# Altium schematic sheet Encoder.SchDoc: Mini Editor Keyboard
size A3; DrawnBy: Roman Sklyar; Organization: S-LAB; Address1: Russian Federation; Address2: Sergiev Posad; DocumentNumber: 5; Revision: v1.0; SheetNumber: 5; SheetTotal: 6
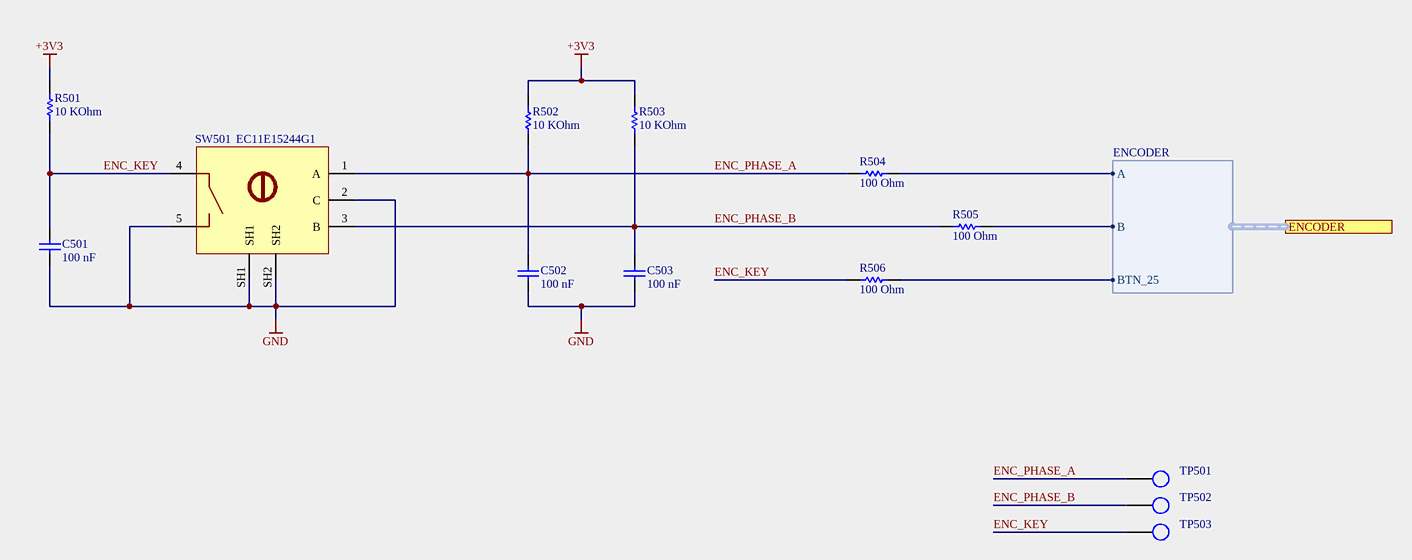
[diagram p0: Encoder.SchDoc]

## Parts
C501  Capacitance: 100 nF  [CAPC0603]  (hidden comment: CAP-100N)
C502  Capacitance: 100 nF  [CAPC0603]  (hidden comment: CAP-100N)
C503  Capacitance: 100 nF  [CAPC0603]  (hidden comment: CAP-100N)
R501  Resistance: 10 KOhm  [RES0603]  (hidden comment: RES-10K)
R502  Resistance: 10 KOhm  [RES0603]  (hidden comment: RES-10K)
R503  Resistance: 10 KOhm  [RES0603]  (hidden comment: RES-10K)
R504  Resistance: 100 Ohm  [RES0603]  (hidden comment: RES-100)
R505  Resistance: 100 Ohm  [RES0603]  (hidden comment: RES-100)
R506  Resistance: 100 Ohm  [RES0603]  (hidden comment: RES-100)
SW501  EC11E15244G1  [EC11E15244G1]
TP501  (no value)  [TP_C-0.5mm]  (no BOM)
TP502  (no value)  [TP_C-0.5mm]  (no BOM)
TP503  (no value)  [TP_C-0.5mm]  (no BOM)

## Ports
ENCODER (harness ENCODER)

## Harnesses
ENCODER: A, B, BTN_25

## Nets
+3V3: R501.2 R502.2 R503.2
GND: C501.1 C502.1 C503.1 SW501.2(C) SW501.5 SW501.SH1 SW501.SH2
ENC_KEY: C501.2 R501.1 R506.1 SW501.4 TP503.1
ENC_PHASE_A: C502.2 R502.1 R504.1 SW501.1(A) TP501.1
ENC_PHASE_B: C503.2 R503.1 R505.1 SW501.3(B) TP502.1
NetR504_2: R504.2 ; port ENCODER.A
NetR505_2: R505.2 ; port ENCODER.B
NetR506_2: R506.2 ; port ENCODER.BTN_25

## Notes on the sheet
- Title
- Size:
- Date:
- A3
- Number:
- Time:
- Revision:
- Sheet
- of
- File:

## Library data of the parts
C501-C503 = CAP-100N: Chip Capacitor, 100 nF, +/- 5%; Voltage Rating: 50 V; Mount: Surface Mount; Tolerance: 5 %; Type: Capacitor
R501-R503 = RES-10K: Chip Resistor, 10 KOhm, +/- 1%; Voltage Rating: 50 V; Mount: Surface Mount; Tolerance: 1 %; Type: Resistor
R504-R506 = RES-100: Chip Resistor, 100 Ohm, +/- 1%; Voltage Rating: 50 V; Mount: Surface Mount; Tolerance: 1 %; Type: Resistor
SW501 = EC11E15244G1: 11mm Size Metal Shaft Type Encoder; Manufacture: Alpsalpine; LengthShaft: 20 mm; NumberPulse: 15; Type: Encoder; Mount: True Hole; PartNumber: EC11E15244G1
TP501-TP503 = TestPad